# Altium project PCB_UI.PrjPcb
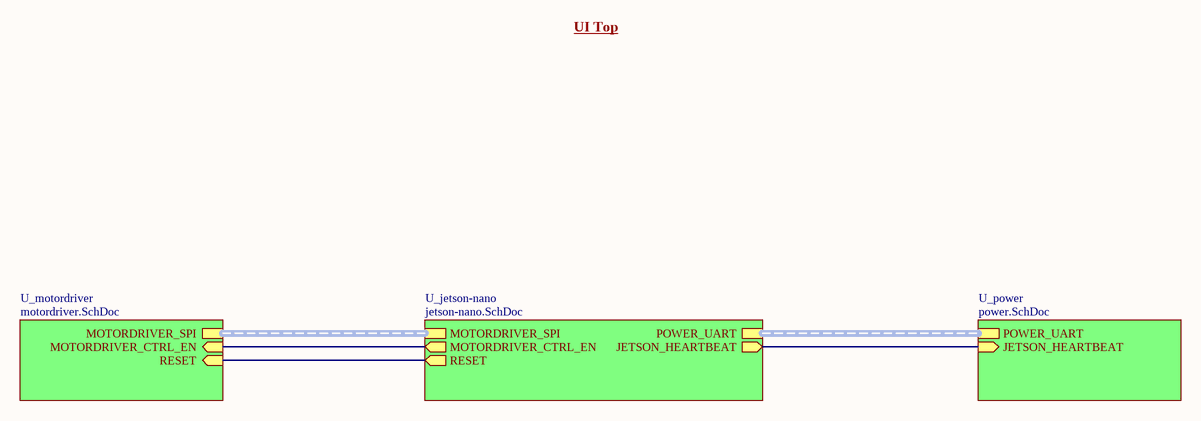
[diagram p0: ui-top.SchDoc]
5 sheets, 12 parts. Net scope: hierarchical (ports join the sheet entries above them; power ports are global).
Sheets:
  ui-top.SchDoc
    U_jetson-nano = jetson-nano.SchDoc
    U_motordriver = motordriver.SchDoc
    U_power = power.SchDoc
  isolation.SchDoc

## Sheet ui-top.SchDoc
size A4; SheetNumber: 1; SheetTotal: 5

### Sub-sheets
U_jetson-nano = jetson-nano.SchDoc: MOTORDRIVER_SPI (harness MOTORDRIVER_SPI), POWER_UART (harness POWER_UART), JETSON_HEARTBEAT (out), MOTORDRIVER_CTRL_EN (out), RESET (out)
U_motordriver = motordriver.SchDoc: MOTORDRIVER_SPI (harness MOTORDRIVER_SPI), MOTORDRIVER_CTRL_EN (in), RESET (in)
U_power = power.SchDoc: POWER_UART (harness POWER_UART), JETSON_HEARTBEAT (in)

### Nets
CTRL_EN_FILTER: sheet U_jetson-nano/MOTORDRIVER_CTRL_EN, sheet U_motordriver/MOTORDRIVER_CTRL_EN
HEARTBEAT_FILTER: sheet U_jetson-nano/JETSON_HEARTBEAT, sheet U_power/JETSON_HEARTBEAT
RESET_FILTER: sheet U_jetson-nano/RESET, sheet U_motordriver/RESET

### Buses and harness runs
harness sheet U_jetson-nano/MOTORDRIVER_SPI = sheet U_motordriver/MOTORDRIVER_SPI
harness sheet U_jetson-nano/POWER_UART = sheet U_power/POWER_UART

### Notes on the sheet
- UI Top

## Sheet jetson-nano.SchDoc
size A3; SheetNumber: 2; SheetTotal: 5
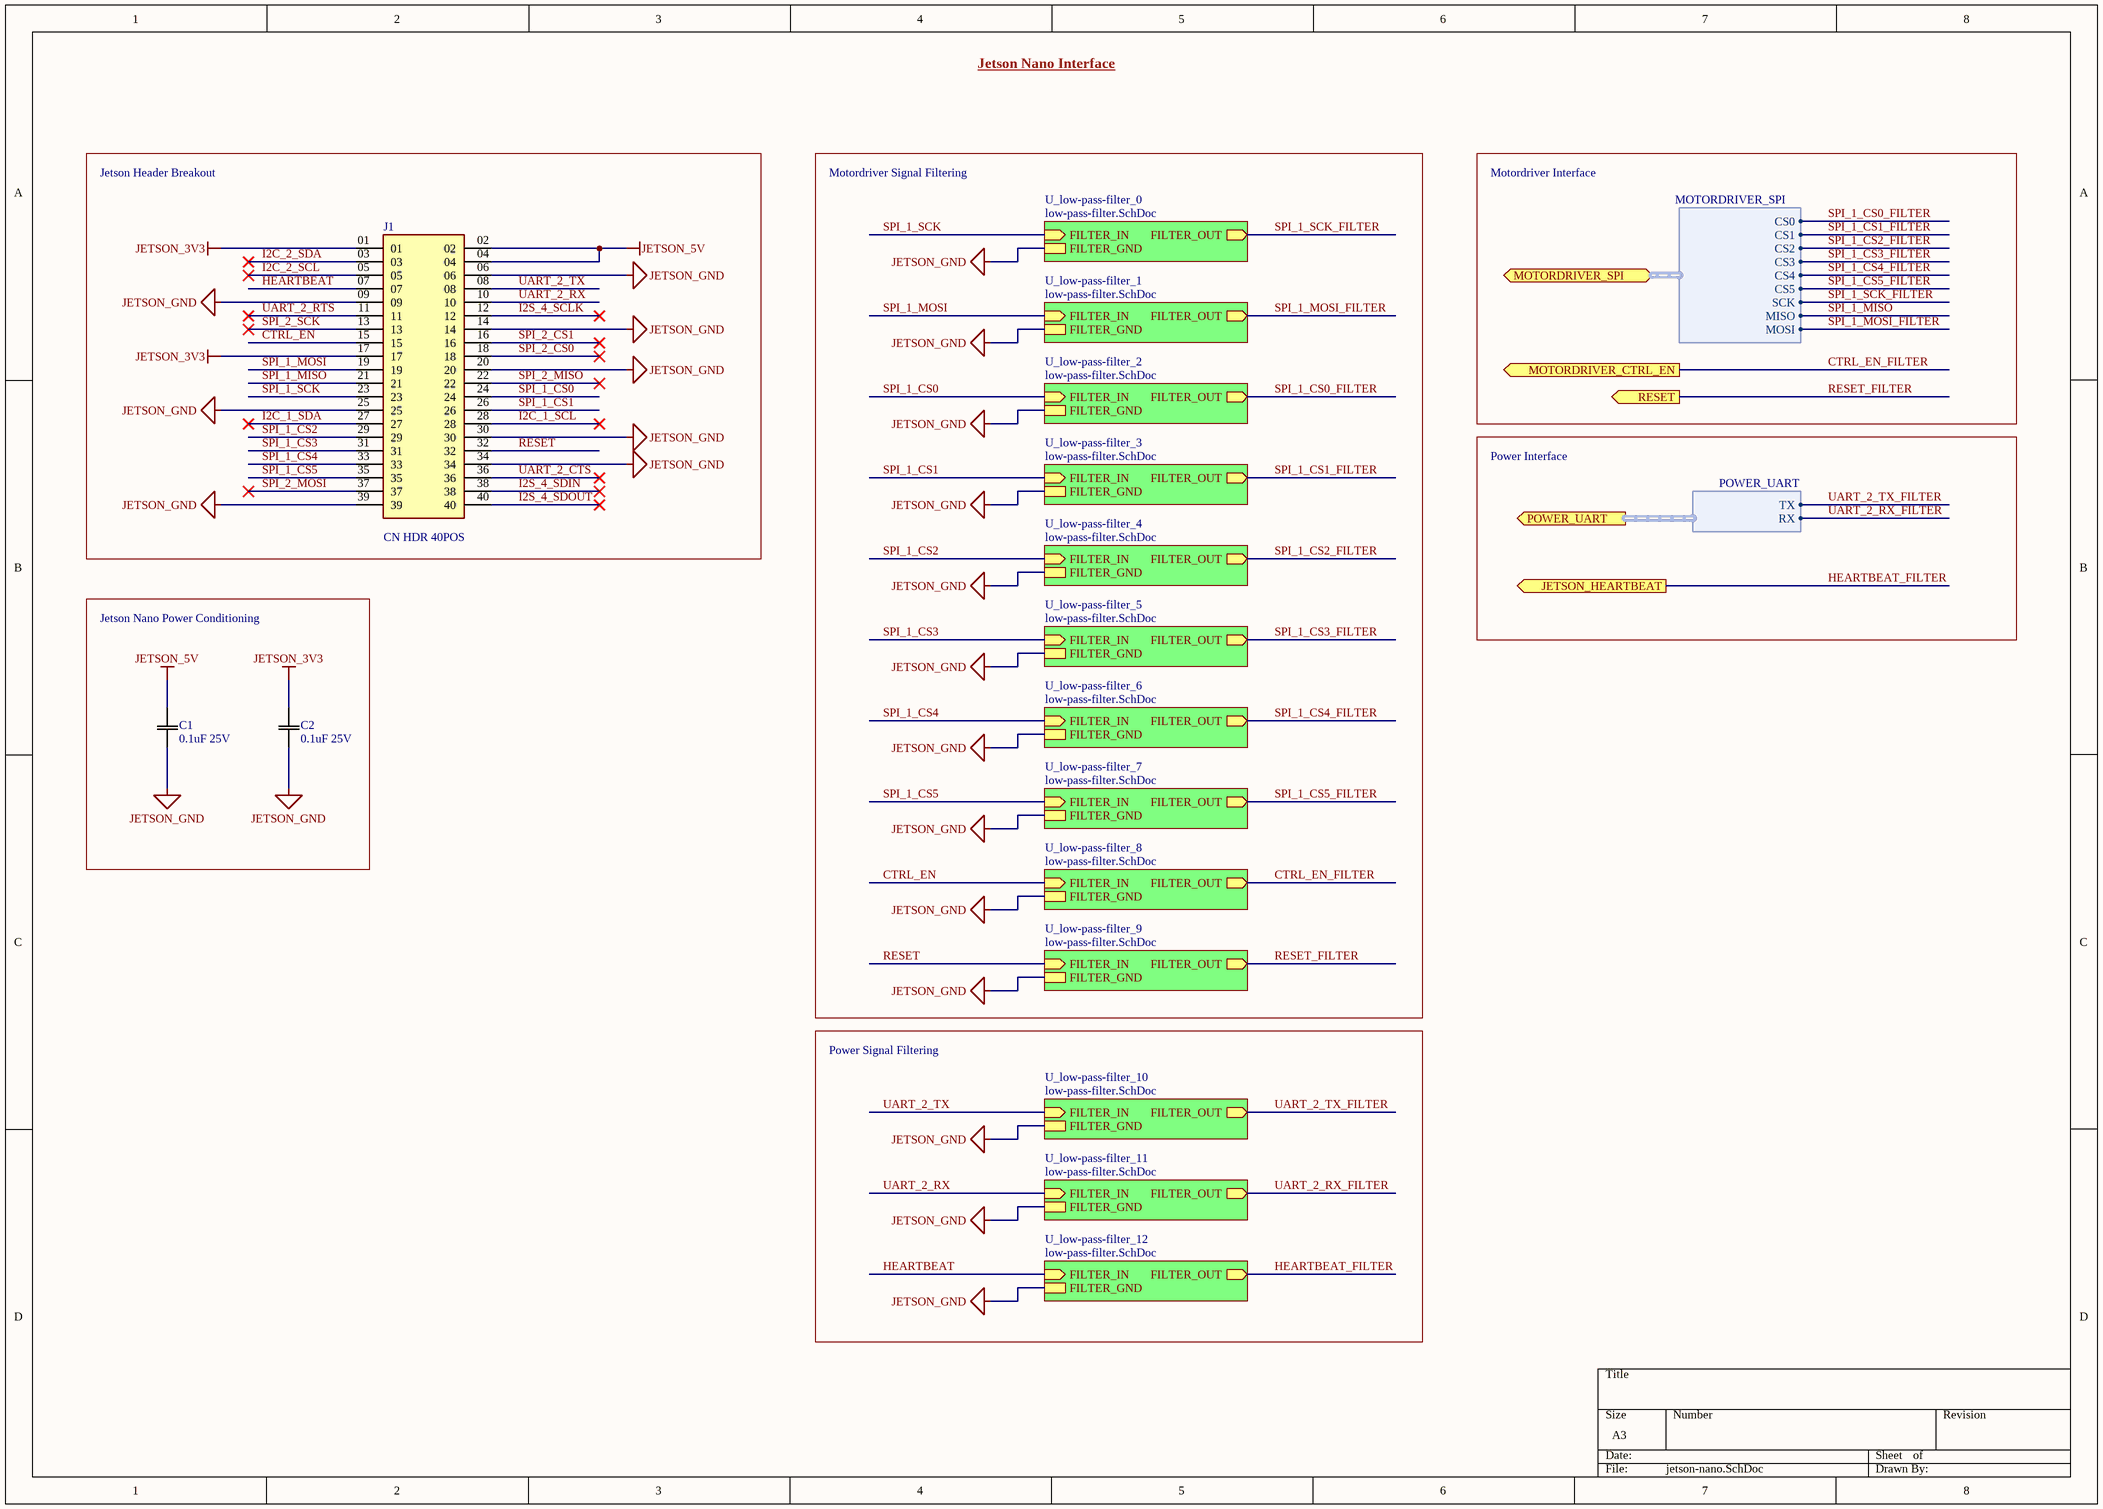
[diagram p1: jetson-nano.SchDoc]

### Parts
C1  0.1uF 25V  [0805]
C2  0.1uF 25V  [0805]
J1  CN HDR 40POS  [CN HDR 40POS 0.1 TH]

### Blocks framed on the sheet
Jetson Header Breakout: J1
Jetson Nano Power Conditioning: C1 C2

### Sub-sheets
U_low-pass-filter_0 = low-pass-filter.SchDoc (file not in this document): FILTER_OUT (out), FILTER_IN (in), FILTER_GND
U_low-pass-filter_1 = low-pass-filter.SchDoc (file not in this document): FILTER_OUT (out), FILTER_IN (in), FILTER_GND
U_low-pass-filter_2 = low-pass-filter.SchDoc (file not in this document): FILTER_OUT (out), FILTER_IN (in), FILTER_GND
U_low-pass-filter_3 = low-pass-filter.SchDoc (file not in this document): FILTER_OUT (out), FILTER_IN (in), FILTER_GND
U_low-pass-filter_4 = low-pass-filter.SchDoc (file not in this document): FILTER_OUT (out), FILTER_IN (in), FILTER_GND
U_low-pass-filter_5 = low-pass-filter.SchDoc (file not in this document): FILTER_OUT (out), FILTER_IN (in), FILTER_GND
U_low-pass-filter_6 = low-pass-filter.SchDoc (file not in this document): FILTER_OUT (out), FILTER_IN (in), FILTER_GND
U_low-pass-filter_7 = low-pass-filter.SchDoc (file not in this document): FILTER_OUT (out), FILTER_IN (in), FILTER_GND
U_low-pass-filter_8 = low-pass-filter.SchDoc (file not in this document): FILTER_OUT (out), FILTER_IN (in), FILTER_GND
U_low-pass-filter_9 = low-pass-filter.SchDoc (file not in this document): FILTER_OUT (out), FILTER_IN (in), FILTER_GND
U_low-pass-filter_10 = low-pass-filter.SchDoc (file not in this document): FILTER_OUT (out), FILTER_IN (in), FILTER_GND
U_low-pass-filter_11 = low-pass-filter.SchDoc (file not in this document): FILTER_OUT (out), FILTER_IN (in), FILTER_GND
U_low-pass-filter_12 = low-pass-filter.SchDoc (file not in this document): FILTER_OUT (out), FILTER_IN (in), FILTER_GND

### Ports
JETSON_HEARTBEAT (out), MOTORDRIVER_CTRL_EN (out), MOTORDRIVER_SPI (bidir, harness MOTORDRIVER_SPI), POWER_UART (out, harness POWER_UART), RESET (out)

### Harnesses
POWER_UART: TX, RX
MOTORDRIVER_SPI: CS0, CS1, CS2, CS3, CS4, CS5, SCK, MISO, MOSI

### Nets
JETSON_3V3: C2.2(C2) J1.01 J1.17
JETSON_5V: C1.2(C2) J1.02 J1.04
JETSON_GND: C1.1(C1) C2.1(C1) J1.06 J1.09 J1.14 J1.20 J1.25 J1.30 J1.34 J1.39 ; sheet U_low-pass-filter_7/FILTER_GND, sheet U_low-pass-filter_0/FILTER_GND, sheet U_low-pass-filter_1/FILTER_GND, sheet U_low-pass-filter_2/FILTER_GND, sheet U_low-pass-filter_3/FILTER_GND, sheet U_low-pass-filter_4/FILTER_GND, sheet U_low-pass-filter_5/FILTER_GND, sheet U_low-pass-filter_6/FILTER_GND, sheet U_low-pass-filter_10/FILTER_GND, sheet U_low-pass-filter_11/FILTER_GND, sheet U_low-pass-filter_12/FILTER_GND, sheet U_low-pass-filter_8/FILTER_GND, sheet U_low-pass-filter_9/FILTER_GND
CTRL_EN: J1.15 ; sheet U_low-pass-filter_8/FILTER_IN
CTRL_EN_FILTER: port MOTORDRIVER_CTRL_EN, sheet U_low-pass-filter_8/FILTER_OUT
HEARTBEAT: J1.07 ; sheet U_low-pass-filter_12/FILTER_IN
HEARTBEAT_FILTER: port JETSON_HEARTBEAT, sheet U_low-pass-filter_12/FILTER_OUT
I2C_1_SCL: J1.28
I2C_1_SDA: J1.27
I2C_2_SCL: J1.05
I2C_2_SDA: J1.03
I2S_4_SCLK: J1.12
I2S_4_SDIN: J1.38
I2S_4_SDOUT: J1.40
RESET: J1.32 ; sheet U_low-pass-filter_9/FILTER_IN
RESET_FILTER: port RESET, sheet U_low-pass-filter_9/FILTER_OUT
SPI_1_CS0: J1.24 ; sheet U_low-pass-filter_2/FILTER_IN
SPI_1_CS0_FILTER: sheet U_low-pass-filter_2/FILTER_OUT, port MOTORDRIVER_SPI.CS0
SPI_1_CS1: J1.26 ; sheet U_low-pass-filter_3/FILTER_IN
SPI_1_CS1_FILTER: sheet U_low-pass-filter_3/FILTER_OUT, port MOTORDRIVER_SPI.CS1
SPI_1_CS2: J1.29 ; sheet U_low-pass-filter_4/FILTER_IN
SPI_1_CS2_FILTER: sheet U_low-pass-filter_4/FILTER_OUT, port MOTORDRIVER_SPI.CS2
SPI_1_CS3: J1.31 ; sheet U_low-pass-filter_5/FILTER_IN
SPI_1_CS3_FILTER: sheet U_low-pass-filter_5/FILTER_OUT, port MOTORDRIVER_SPI.CS3
SPI_1_CS4: J1.33 ; sheet U_low-pass-filter_6/FILTER_IN
SPI_1_CS4_FILTER: sheet U_low-pass-filter_6/FILTER_OUT, port MOTORDRIVER_SPI.CS4
SPI_1_CS5: J1.35 ; sheet U_low-pass-filter_7/FILTER_IN
SPI_1_CS5_FILTER: sheet U_low-pass-filter_7/FILTER_OUT, port MOTORDRIVER_SPI.CS5
SPI_1_MISO: J1.21 ; port MOTORDRIVER_SPI.MISO
SPI_1_MOSI: J1.19 ; sheet U_low-pass-filter_1/FILTER_IN
SPI_1_MOSI_FILTER: sheet U_low-pass-filter_1/FILTER_OUT, port MOTORDRIVER_SPI.MOSI
SPI_1_SCK: J1.23 ; sheet U_low-pass-filter_0/FILTER_IN
SPI_1_SCK_FILTER: sheet U_low-pass-filter_0/FILTER_OUT, port MOTORDRIVER_SPI.SCK
SPI_2_CS0: J1.18
SPI_2_CS1: J1.16
SPI_2_MISO: J1.22
SPI_2_MOSI: J1.37
SPI_2_SCK: J1.13
UART_2_CTS: J1.36
UART_2_RTS: J1.11
UART_2_RX: J1.10 ; sheet U_low-pass-filter_11/FILTER_IN
UART_2_RX_FILTER: sheet U_low-pass-filter_11/FILTER_OUT, port POWER_UART.RX
UART_2_TX: J1.08 ; sheet U_low-pass-filter_10/FILTER_IN
UART_2_TX_FILTER: sheet U_low-pass-filter_10/FILTER_OUT, port POWER_UART.TX

### Notes on the sheet
- Jetson Nano Interface
- Motordriver Signal Filtering
- Motordriver Interface
- Power Interface
- Power Signal Filtering

### Library data of the parts
C1 C2 = CAP 0.1uF 25V: Default Symbol for Capacitors; Temperature Coefficient: X7R; Tolerance: 10%; Value: 0.1uF; Rating: 25V; Operating Temperature: -55°C ~ 125°C; Part Number: CAP 0.1uF 25V
J1 = CN HDR 40POS: 40 Position Header Connector; Part Number: CN HDR 40POS; Supplier 1: Digi-Key; Supplier Part Number 1: S6104-ND; Pin Count: 40; Supplier URL 1: https://www.digikey.ca/en/products/detail/sullins-connector-solutions/PPTC202LFBN-RC/807240?s=N4IgTCBcDaIMoDYCMAGALAWgHIBEQF0BfIA

## Sheet motordriver.SchDoc
size A4; SheetNumber: 4; SheetTotal: 5
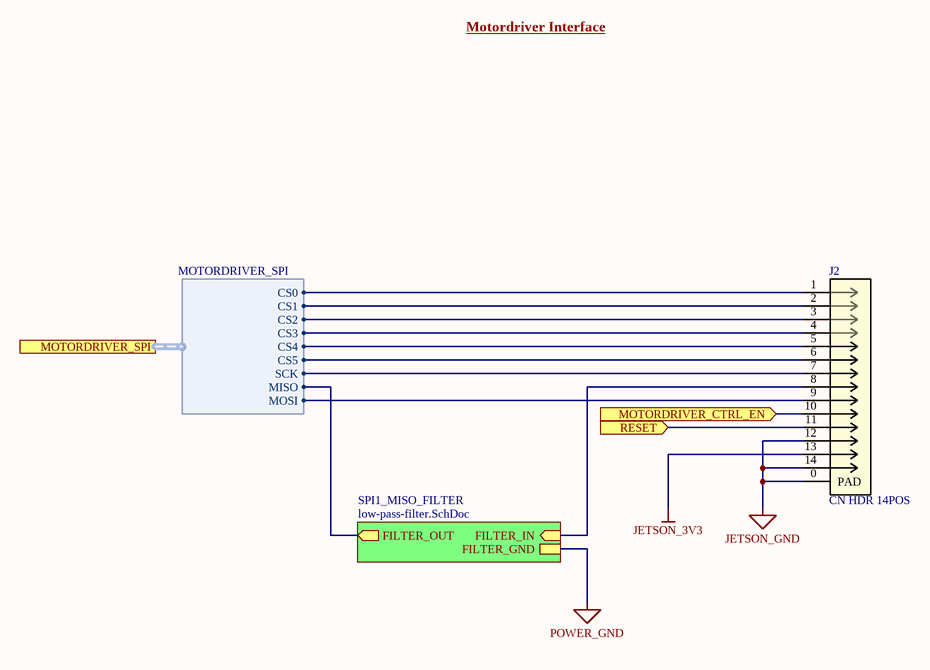
[diagram p2: motordriver.SchDoc]

### Parts
J2  CN HDR 14POS  [CN HDR 14POS SMD 1.5MM]

### Sub-sheets
SPI1_MISO_FILTER = low-pass-filter.SchDoc (file not in this document): FILTER_OUT (out), FILTER_IN (in), FILTER_GND

### Ports
MOTORDRIVER_CTRL_EN (in), MOTORDRIVER_SPI (harness MOTORDRIVER_SPI), RESET (in)

### Harnesses
MOTORDRIVER_SPI: CS0, CS1, CS2, CS3, CS4, CS5, SCK, MISO, MOSI

### Nets
JETSON_3V3: J2.13
JETSON_GND: J2.0(PAD) J2.12 J2.14
CTRL_EN_FILTER: J2.10 ; port MOTORDRIVER_CTRL_EN
RESET_FILTER: J2.11 ; port RESET
SPI_1_CS0_FILTER: J2.1 ; port MOTORDRIVER_SPI.CS0
SPI_1_CS1_FILTER: J2.2 ; port MOTORDRIVER_SPI.CS1
SPI_1_CS2_FILTER: J2.3 ; port MOTORDRIVER_SPI.CS2
SPI_1_CS3_FILTER: J2.4 ; port MOTORDRIVER_SPI.CS3
SPI_1_CS4_FILTER: J2.5 ; port MOTORDRIVER_SPI.CS4
SPI_1_CS5_FILTER: J2.6 ; port MOTORDRIVER_SPI.CS5
SPI_1_MISO: sheet SPI1_MISO_FILTER/FILTER_OUT, port MOTORDRIVER_SPI.MISO
SPI_1_MOSI_FILTER: J2.9 ; port MOTORDRIVER_SPI.MOSI
SPI_1_SCK_FILTER: J2.7 ; port MOTORDRIVER_SPI.SCK
NetJ2_8: J2.8 ; sheet SPI1_MISO_FILTER/FILTER_IN

### Notes on the sheet
- Motordriver Interface

### Library data of the parts
J2 = CN HDR 14POS: Connector Header 14 Position; Part Number: CN HDR 14POS; Supplier 1: Digi-Key; Supplier Part Number 1: 455-4210-1-ND; Supplier URL 1: https://www.digikey.ca/en/products/detail/jst-sales-america-inc/BM14B-ZESS-TBT-LF-SN/1886998?s=N4IgTCBcDaICwFYEFo5gIwAZnuQOQBEQBdAXyA; Pin Count: 14

## Sheet power.SchDoc
size A4; SheetNumber: 5; SheetTotal: 5
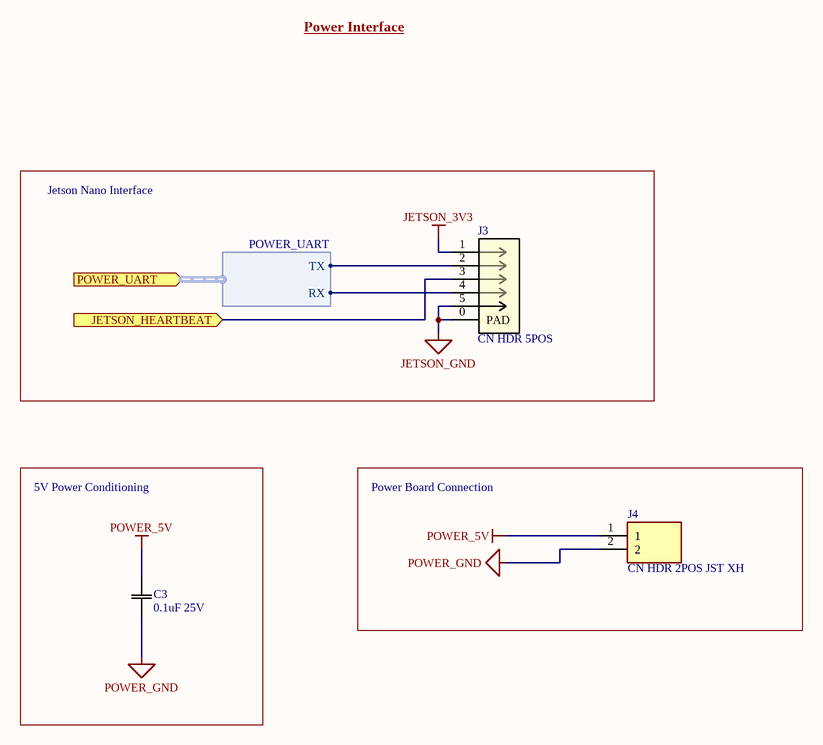
[diagram p3: power.SchDoc]

### Parts
C3  0.1uF 25V  [0805]
J3  CN HDR 5POS  [CN HDR 5POS SMD 1.5MM]
J4  CN HDR 2POS JST XH  [JST_B2B-XH-A(LF)(SN)]

### Blocks framed on the sheet
Jetson Nano Interface: J3
5V Power Conditioning: C3
Power Board Connection: J4

### Ports
JETSON_HEARTBEAT (in), POWER_UART (in, harness POWER_UART)

### Harnesses
POWER_UART: TX, RX

### Nets
JETSON_3V3: J3.1
JETSON_GND: J3.0(PAD) J3.5
POWER_5V: C3.2(C2) J4.1
POWER_GND: C3.1(C1) J4.2
HEARTBEAT_FILTER: J3.3 ; port JETSON_HEARTBEAT
UART_2_RX_FILTER: J3.4 ; port POWER_UART.RX
UART_2_TX_FILTER: J3.2 ; port POWER_UART.TX

### Notes on the sheet
- Power Interface

### Library data of the parts
C3 = CAP 0.1uF 25V: as C1 on sheet jetson-nano; Value: 0.1uF; Rating: 25V; Operating Temperature: -55°C ~ 125°C; Part Number: CAP 0.1uF 25V
J3 = CN HDR 5POS: Connector Header 5 Position; Part Number: CN HDR 5POS; Supplier 1: Digi-Key; Supplier Part Number 1: 455-2383-1-ND; Supplier URL 1: https://www.digikey.ca/en/products/detail/jst-sales-america-inc/BM05B-ZESS-TBT-LF-SN/1886989?s=N4IgTCBcDaICwFYEFowGYAcbkEZkDkAREAXQF8g; Pin Count: 5
J4 = CN HDR 2POS JST XH: Connector Header Through Hole 2 position 0.098 _2.50mm_ / JST XH; MP: B2B-XH-A_LF__SN_; MF: JST Sales; Price: None; Package: None; Value: *; SnapEDA_Link: https://www.snapeda.com/parts/B2B-XH-A%28LF%29%28SN%29/JST%20Sales%20America%20Inc./view-part/492310/?ref=snap; Part Number: CN HDR 2POS JST XH; Pin Count: 2

## Sheet isolation.SchDoc
size A4; SheetNumber: 2; SheetTotal: 6
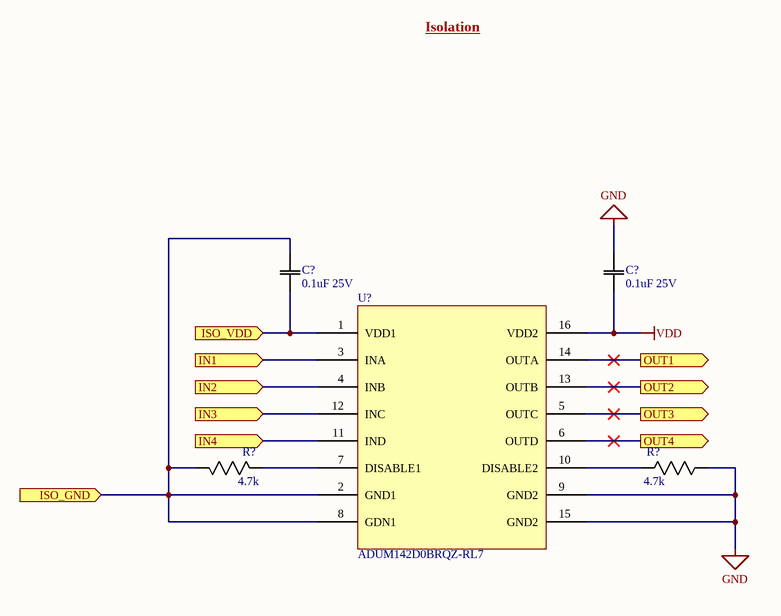
[diagram p4: isolation.SchDoc]

### Parts
(Parts that share a designator on the sheet are numbered #1, #2 ... from top to bottom, then left to right.)
C?#1  0.1uF 25V  [0805]
C?#2  0.1uF 25V  [0805]
R?#1  4.7k  [0603]
R?#2  4.7k  [0603]
U?  ADUM142D0BRQZ-RL7  [SOP64P600X175-16N]

### Ports
IN1 (in), IN2 (in), IN3 (in), IN4 (in), ISO_GND (in), ISO_VDD (in), OUT1 (out), OUT2 (out), OUT3 (out), OUT4 (out)

### Nets
GND: C?#2.2(C2) R?#2.1(R1) U?.9(GND2) U?.15(GND2)
VDD: C?#2.1(C1) U?.16(VDD2)
NetC?#1_1: C?#1.1(C1) U?.1(VDD1) ; port ISO_VDD
NetC?#1_2: C?#1.2(C2) R?#1.1(R1) U?.2(GND1) U?.8(GDN1) ; port ISO_GND
NetR?#1_2: R?#1.2(R2) U?.7(DISABLE1)
NetR?#2_2: R?#2.2(R2) U?.10(DISABLE2)
NetU?_3: U?.3(INA) ; port IN1
NetU?_4: U?.4(INB) ; port IN2
NetU?_5: U?.5(OUTC) ; port OUT3
NetU?_6: U?.6(OUTD) ; port OUT4
NetU?_11: U?.11(IND) ; port IN4
NetU?_12: U?.12(INC) ; port IN3
NetU?_13: U?.13(OUTB) ; port OUT2
NetU?_14: U?.14(OUTA) ; port OUT1

### Notes on the sheet
- Isolation

### Library data of the parts
C?#1 C?#2 = CAP 0.1uF 25V: as C1 on sheet jetson-nano; Value: 0.1uF; Rating: 25V; Operating Temperature: -55°C ~ 125°C; Part Number: CAP 0.1uF 25V
R?#1 R?#2 = RES 4.7k 1/8W - 5%: Default Resistor Symbol; Value: 1; Power (Watts): 0.125W; Tolerance: 5%; Package: 0805; Part Number: RES 4.7k 1/8W - 5%
U? = ADUM142D0BRQZ-RL7: DGTL ISO 3000VRMS 4CH GP 16QSOP; Part Number: ADUM142D0BRQZ-RL7; Supplier 1: Digi-Key; Supplier Part Number 1: 505-ADUM142D0BRQZ-RL7CT-ND; Suppler URL 1: https://www.digikey.ca/en/products/detail/analog-devices-inc/ADUM142D0BRQZ-RL7/7388629

## Nets that join several sheets
JETSON_3V3: jetson-nano (C2.2 J1.01 J1.17), motordriver (J2.13), power (J3.1)
JETSON_GND: jetson-nano (10 pins), motordriver (J2.0 J2.12 J2.14), power (J3.0 J3.5)